# Altium schematic sheet MDL_RECEPTOR_IRF.SchDoc
size A4
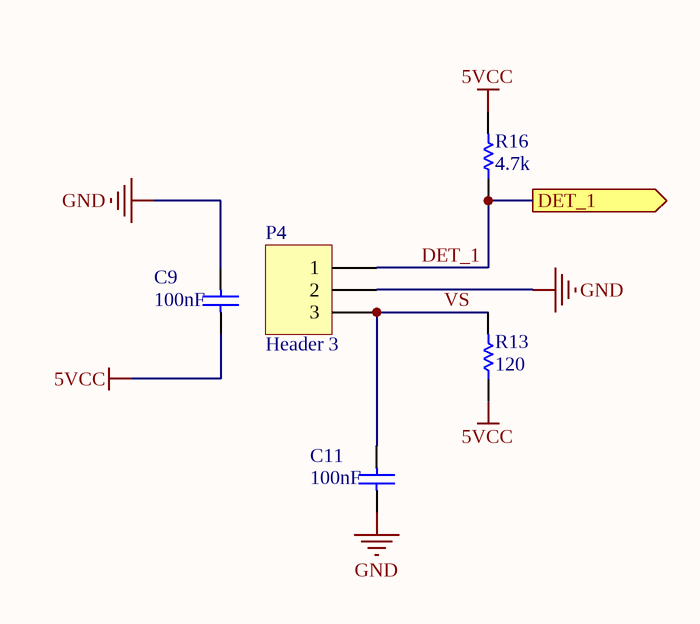
[diagram p0: MDL_RECEPTOR_IRF.SchDoc]

## Parts
C9  value 100nF  [VP44-2.5]  (hidden comment: VP44BY224JB)
C11  value 100nF  [VP44-2.5]  (hidden comment: VP44BY224JB)
P4  Header 3  [HDR1X3]
R13  value 120  [AXIAL-0.3]  (hidden comment: Res)
R16  value 4.7k  [AXIAL-0.3]  (hidden comment: Res)

## Ports
DET_1 (out)

## Nets
5VCC: C9.2 R13.1 R16.2
GND: C9.1 C11.2 P4.2
DET_1: P4.1 R16.1 ; port DET_1
VS: C11.1 P4.3 R13.2

## Library data of the parts
C9 C11 = VP44BY224JB: Dipped Radial Multilayer Ceramic Capacitor X7R: 220nF, 100V; Published: 17-Dec-2003; DatasheetDocument: 4-Feb-2002; PackageDocument: 4-Feb-2002; PackageReference: VP44-2.5; Publisher: Altium Limited; ComponentLink1Description: Manufacturer Link; ComponentLink1URL: http://www.vishay.com/
P4 = Header 3: Header, 3-Pin; LatestRevisionDate: 17-Jul-2002; LatestRevisionNote: Re-released for DXP Platform.; Publisher: Altium Limited
R13 R16 = Res1: Resistor; Published: 8-Jun-2000; LatestRevisionDate: 17-Jul-2002; LatestRevisionNote: Re-released for DXP Platform.; PackageReference: AXIAL-0.3; Publisher: Altium Limited